# Altium schematic sheet [31] - PWR BATTERY CHARGER.SchDoc
size A3; DocumentNumber: 31; SheetNumber: 31; SheetTotal: 32
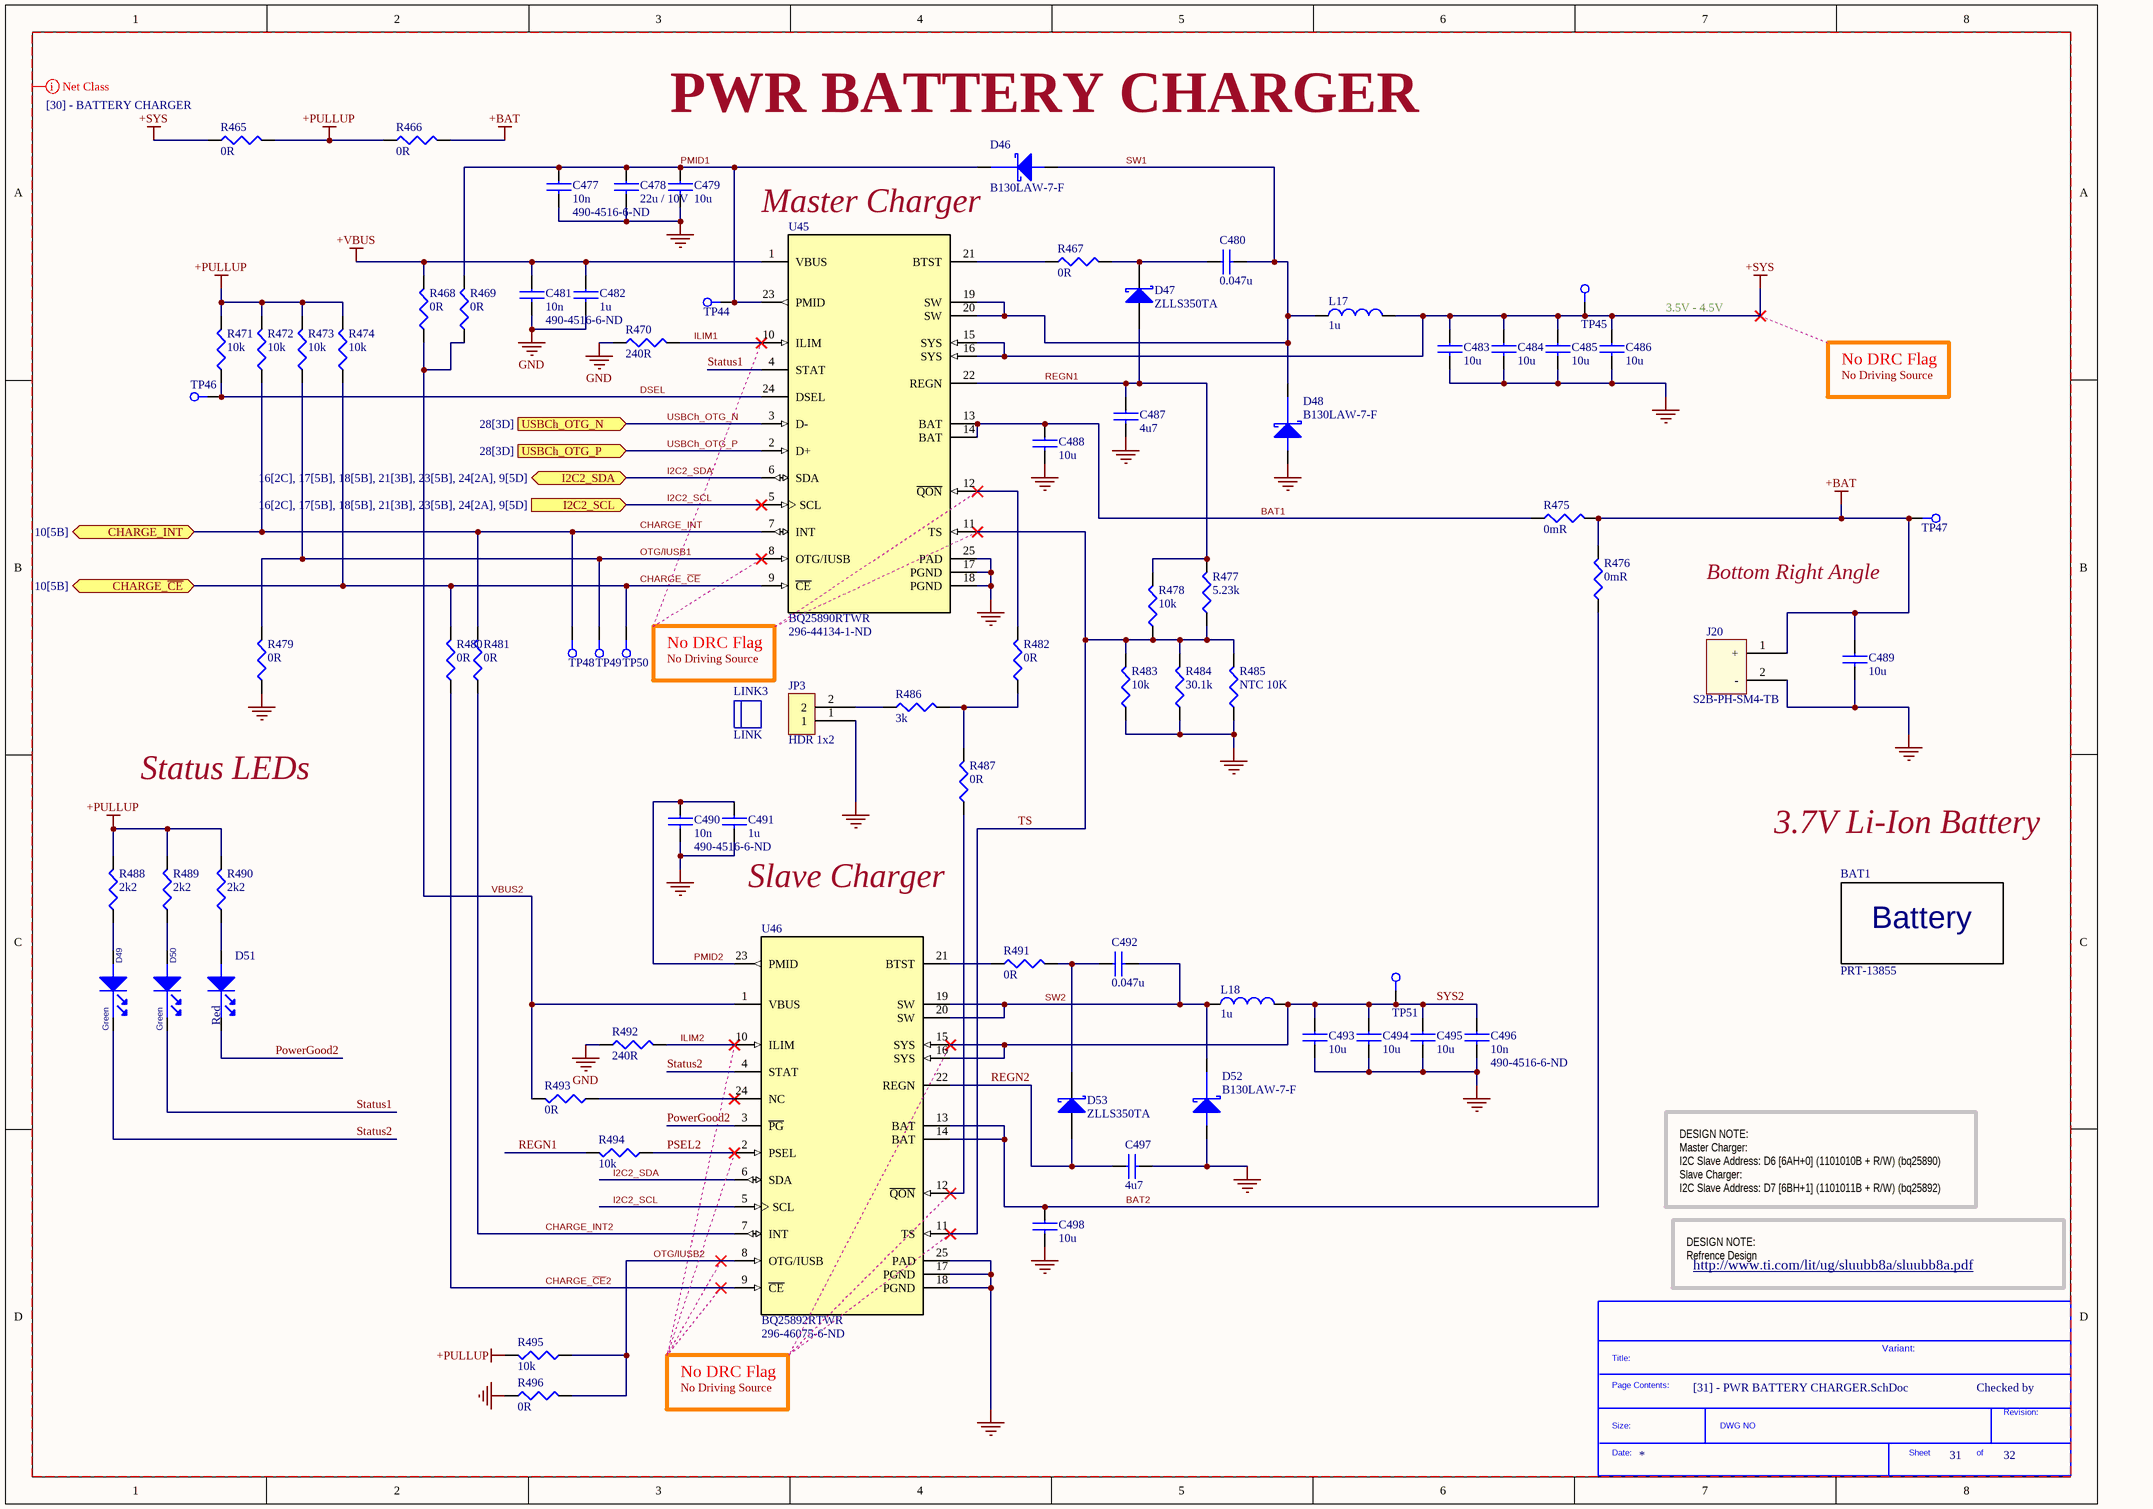
[diagram p0: [31] - PWR BATTERY CHARGER.SchDoc]

## Parts
*  SDTitleBlock  (value not drawn)  (graphical)
BAT1  PRT-13855  [Li-Ion Bat]
C477  10n  Supplier Part Number 2: 490-4516-6-ND  [C0402]
C478  22u / 10V  [C0603]
C479  10u  [C0603]
C480  0.047u  [C0402]
C481  10n  Supplier Part Number 2: 490-4516-6-ND  [C0402]
C482  1u  [C0402]
C483  10u  [C0603]
C484  10u  [C0603]
C485  10u  [C0603]
C486  10u  [C0603]
C487  4u7  [C0402]
C488  10u  [C0603]
C489  10u  [C0603]
C490  10n  Supplier Part Number 2: 490-4516-6-ND  [C0402]
C491  1u  [C0402]
C492  0.047u  [C0402]
C493  10u  [C0603]
C494  10u  [C0603]
C495  10u  [C0603]
C496  10n  Supplier Part Number 2: 490-4516-6-ND  [C0402]
C497  4u7  [C0402]
C498  10u  [C0603]
D46  B130LAW-7-F  [SOD-123FL]
D47  ZLLS350TA  [SOD-523]
D48  B130LAW-7-F  [SOD-123FL]
D49  Green  [LED_0603]
D50  Green  [LED_0603]
D51  Red  [LED_0603]
D52  B130LAW-7-F  [SOD-123FL]
D53  ZLLS350TA  [SOD-523]
J20  S2B-PH-SM4-TB  [S2B-PH-SM4-TB]
JP3  HDR 1x2  [HDR_1x2_2.54MM]
L17  1u  [IHLP_204MILX216MIL]
L18  1u  [IHLP_204MILX216MIL]
LINK3  LINK  (mechanical)
R465  0R  [R0402]
R466  0R  [R0402]
R467  0R  [R0402]
R468  0R  [R0402]
R469  0R  [R0402]
R470  240R  [R0201]
R471  10k  [R0201]
R472  10k  [R0201]
R473  10k  [R0201]
R474  10k  [R0201]
R475  0mR  [R2512]
R476  0mR  [R2512]
R477  5.23k  [R0402]
R478  10k  [R0402]
R479  0R  [R0402]
R480  0R  [R0402]
R481  0R  [R0402]
R482  0R  [R0402]
R483  10k  [R0402]
R484  30.1k  [R0402]
R485  NTC 10K  [R0402]
R486  3k  [R0402]
R487  0R  [R0402]
R488  2k2  [R0402]
R489  2k2  [R0402]
R490  2k2  [R0402]
R491  0R  [R0402]
R492  240R  [R0201]
R493  0R  [R0402]
R494  10k  [R0201]
R495  10k  [R0201]
R496  0R  [R0402]
TP44  TP_25MILC  [TP_25C]  (value not drawn)  (no BOM)
TP45  TP_25MILC  [TP_25C]  (value not drawn)  (no BOM)
TP46  TP_25MILC  [TP_25C]  (value not drawn)  (no BOM)
TP47  TP_25MILC  [TP_25C]  (value not drawn)  (no BOM)
TP48  TP_25MILC  [TP_25C]  (value not drawn)  (no BOM)
TP49  TP_25MILC  [TP_25C]  (value not drawn)  (no BOM)
TP50  TP_25MILC  [TP_25C]  (value not drawn)  (no BOM)
TP51  TP_25MILC  [TP_25C]  (value not drawn)  (no BOM)
U45  BQ25890RTWR  Supplier Part Number 2: 296-44134-1-ND  [RTW0024H]
U46  BQ25892RTWR  Supplier Part Number 1: 296-46075-6-ND  [RTW0024H]

## Ports
CHARGE_INT (bidir, see 10[5B]), CHARGE_~{CE} (bidir, see 10[5B]), I2C2_SCL (in, see 16[2C], 17[5B], 18[5B], 21[3B], 23[5B], 24[2A], 9[5D]), I2C2_SDA (bidir, see 16[2C], 17[5B], 18[5B], 21[3B], 23[5B], 24[2A], 9[5D]), USBCh_OTG_N (in, see 28[3D]), USBCh_OTG_P (in, see 28[3D])

## Nets
+BAT: C489.1 J20.1(+) R466.2 R475.2 R476.2 TP47.1
+PULLUP: R465.2 R466.1 R471.2 R472.2 R473.2 R474.2 R488.2 R489.2 R490.2 R495.2
+SYS: C483.1 C484.1 C485.1 C486.1 L17.2 R465.1 TP45.1 U45.15(SYS) U45.16(SYS)
+VBUS: C481.1 C482.1 R468.2 U45.1(VBUS)
GND: C477.2 C478.2 C479.2 C481.2 C482.2 C483.2 C484.2 C485.2 C486.2 C487.2 C488.2 C489.2 C490.2 C491.2 C493.2 C494.2 C495.2 C496.2 C497.2 C498.2 D48.2(Anode) D52.2(Anode) J20.2(-) JP3.1 R470.1 R479.1 R483.1 R484.1 R485.1 R492.1 R496.1 U45.17(PGND) U45.18(PGND) U45.25(PAD) U46.17(PGND) U46.18(PGND) U46.25(PAD)
BAT1: C488.1 R475.1 U45.13(BAT) U45.14(BAT)
BAT2: C498.1 R476.1 U46.13(BAT) U46.14(BAT)
CHARGE_~{CE}: R474.1 R480.2 TP50.1 U45.9(~{CE}) ; port CHARGE_~{CE}
CHARGE_~{CE}2: R480.1 U46.9(~{CE})
CHARGE_INT: R472.1 R481.2 TP48.1 U45.7(INT) ; port CHARGE_INT
CHARGE_INT2: R481.1 U46.7(INT)
DSEL: R471.1 TP46.1 U45.24(DSEL)
I2C2_SCL: U45.5(SCL) U46.5(SCL) ; port I2C2_SCL
I2C2_SDA: U45.6(SDA) U46.6(SDA) ; port I2C2_SDA
ILIM1: R470.2 U45.10(ILIM)
ILIM2: R492.2 U46.10(ILIM)
OTG/IUSB1: R473.1 R479.2 TP49.1 U45.8(OTG/IUSB)
OTG/IUSB2: R495.1 R496.2 U46.8(OTG/IUSB)
PMID1: C477.1 C478.1 C479.1 D46.1(Cathode) R469.2 TP44.1 U45.23(PMID)
PMID2: C490.1 C491.1 U46.23(PMID)
PowerGood2: D51.1(cathode) U46.3(~{PG})
PSEL2: R494.1 U46.2(PSEL)
REGN1: C487.1 D47.2(A) R477.2 R478.2 R494.2 U45.22(REGN)
REGN2: C497.1 D53.2(A) U46.22(REGN)
Status1: D50.1(cathode) U45.4(STAT)
Status2: D49.1(cathode) U46.4(STAT)
SW1: C480.2 D46.2(Anode) D48.1(Cathode) L17.1 U45.19(SW) U45.20(SW)
SW2: C492.2 D52.1(Cathode) L18.1 U46.19(SW) U46.20(SW)
SYS2: C493.1 C494.1 C495.1 C496.1 L18.2 TP51.1 U46.15(SYS) U46.16(SYS)
TS: R477.1 R478.1 R483.2 R484.2 R485.2 U45.11(TS) U46.11(TS)
USBCh_OTG_N: U45.3(D-) ; port USBCh_OTG_N
USBCh_OTG_P: U45.2(D+) ; port USBCh_OTG_P
VBUS2: R468.1 R469.1 R493.2 U46.1(VBUS)
NetC480_1: C480.1 D47.1(K) R467.2
NetC492_1: C492.1 D53.1(K) R491.2
NetD49_2: D49.2(ANODE) R488.1
NetD50_2: D50.2(ANODE) R489.1
NetD51_2: D51.2(ANODE) R490.1
NetJP3_2: JP3.2 R486.1
NetR467_1: R467.1 U45.21(BTST)
NetR482_1: R482.1 R486.2 R487.2
NetR482_2: R482.2 U45.12(~{QON})
NetR487_1: R487.1 U46.12(~{QON})
NetR491_1: R491.1 U46.21(BTST)
NetR493_1: R493.1 U46.24(NC)

## Layout directives
net class [30] - BATTERY CHARGER: +BAT, +PULLUP, +SYS, +VBUS, BAT1, BAT2, CHARGE_INT, CHARGE_INT2, CHARGE_~{CE}, CHARGE_~{CE}2, DSEL, GND, I2C2_SCL, I2C2_SDA, ILIM1, ILIM2, OTG/IUSB1, OTG/IUSB2, PMID1, PMID2, PowerGood2, PSEL2, REGN1, REGN2, Status1, Status2, SW1, SW2, SYS2, TS, USBCh_OTG_N, USBCh_OTG_P, VBUS2

## Notes on the sheet
- (near D46) PWR BATTERY CHARGER
- (near D46) Master Charger
- 3.5V - 4.5V
- No DRC Flag
- No Driving Source
- Bottom Right Angle
- Status LEDs
- 3.7V Li-Ion Battery
- (near C491) Slave Charger
- DESIGN NOTE:
  Master Charger:
  I2C Slave Address: D6 [6AH+0] (1101010B + R/W) (bq25890)
  Slave Charger:
  I2C Slave Address: D7 [6BH+1] (1101011B + R/W) (bq25892)
- DESIGN NOTE:
  Refrence Design
- http://www.ti.com/lit/ug/sluubb8a/sluubb8a.pdf
- Variant:
- Checked by
- (in symbol PRT-13855) Battery
- (in symbol SDTitleBlock) Title:; Page Contents:; Revision:; Size:; DWG NO; Date:; Sheet; of

## Library data of the parts
BAT1 = PRT-13855: LITHIUM ION BATTERY - 2AH; Manufacturer: SparkFun Electronics; Battery Chemistry: Lithium-Ion; Shipping Info: Due to possible restrictions, a change in ship method may be required.; .Creator: MB; Supplier 1: Digi-Key; Manufacturer Part Number: PRT-13855; RoHS: Not Applicable; Category: Battery Products; Stock 1: 246; Pricing 1: 1=12.95 (USD); Part Status: Active; Battery Cell Size: -; Capacity: 2Ah; Size / Dimension: 2.40" L x 2.10" W x 0.25" H (61.0mm x 53.3mm x 6.4mm); Termination Style: Wire Leads with Connector; Discharge Rate: -; Standard Charge Current: -; Standard Charge Time: -; Weight: -; ComponentLink1URL: https://media.digikey.com/pdf/Data%20Sheets/Sparkfun%20PDFs/PRT-13855_Web.pdf; ComponentLink1Description: https://media.digikey.com/pdf/Data%20Sheets/Sparkfun%20PDFs/PRT-13855_Web.pdf; Supplier Part Number 1: 1568-1686-ND; .Checked PCB: *
C477 C481 C490 C496 = C1005X7R1H103K: CAP CER 10000PF 50V 10% X7R 0402; Manufacturer: TDK Corporation; Value: 10nF; .Checked PCB: used; Capacitance: 10000pF; Category: Capacitors; Supplier Part Number: 445-6850-1-ND; Manufacturer Part Number: C1005X7R1H103K; Operating Temperature: -55°C ~ 125°C; Package / Case: 0402 (1005 Metric); Price 1k [$]: 0.01625; .Checked SCH: used; Voltage - Rated: 50V; Supplier: Digikey; Supplier 1: Digi-Key; Supplier Part Number 1: 445-6850-1-ND; RoHS: RoHS Compliant; Stock 1: 3901; Pricing 1: 1=0.2, 10=0.125, 100=0.045, 250=0.03252, 500=0.024, 1000=0.01625 (USD); Tolerance: ±10%; Temperature Coefficient: X7R; Mounting Type: Surface Mount, MLCC; Applications: General Purpose; Ratings: -; Size / Dimension: 0.039" L x 0.020" W (1.00mm x 0.50mm); Height - Seated (Max): -; Thickness (Max): 0.022" (0.55mm); Lead Spacing: -; Features: -; Packaging: Cut Tape (CT); Lead Style: -; ComponentLink1URL: http://www.tdk.co.jp/tefe02/e412_c.pdf; ComponentLink1Description: http://www.tdk.co.jp/tefe02/e412_c.pdf; Supplier 2: Digi-Key
C478 = C1608X5R1A226M080AC: CAP CER 22UF 10V X5R 0603; Manufacturer: TDK Corporation; Capacitance: 22µF; Tolerance: ±20%; .Creator: MM; .Checked SCH: used; Supplier 1: Digi-Key; Manufacturer Part Number: C1608X5R1A226M080AC; RoHS: RoHS Compliant; Category: Capacitors; Stock 1: 405620; Pricing 1: 1=0.49, 10=0.469, 100=0.2275, 250=0.189, 500=0.1715, 1000=0.1575 (USD); Packaging: Cut Tape (CT); Voltage - Rated: 10V; Temperature Coefficient: X5R; Mounting Type: Surface Mount, MLCC; Operating Temperature: -55°C ~ 85°C; Applications: General Purpose; Ratings: -; Package / Case: 0603 (1608 Metric); Size / Dimension: 0.063" L x 0.031" W (1.60mm x 0.80mm); Height - Seated (Max): -; Thickness (Max): 0.035" (0.90mm); Lead Spacing: -; Features: -; Lead Style: -; ComponentLink1URL: http://product.tdk.com/en/catalog/datasheets/mlcc_commercial_general_en.pdf; ComponentLink1Description: http://product.tdk.com/en/catalog/datasheets/mlcc_commercial_general_en.pdf; Supplier Part Number 1: 445-9077-1-ND; .Checked PCB: used; Supplier 2: Digi-Key; Supplier Part Number 2: 1276-1274-1-ND
C479 C483-C486 C488 C489 C493-C495 C498 = C1608X5R0J106M: CAP CER 10UF 6.3V X5R 20% 0603; Manufacturer: TDK Corporation; Capacitance: 10µF; Value: 10µF; .Checked PCB: used; Category: Capacitors; Supplier Part Number: 445-4112-1-ND; Manufacturer Part Number: C1608X5R0J106M; Operating Temperature: -55°C ~ 85°C; Package / Case: 0603 (1608 Metric); Price 1k [$]: 0.08580; .Checked SCH: used; Voltage - Rated: 6.3V; Features: Low ESR; Supplier: Digikey; Supplier 1: Digi-Key; Supplier Part Number 1: 445-4112-1-ND; RoHS: RoHS Compliant; Stock 1: 48157; Pricing 1: 1=0.46, 10=0.363, 100=0.1898, 250=0.14024, 500=0.1089, 1000=0.0858 (USD); Tolerance: ±20%; Temperature Coefficient: X5R; Mounting Type: Surface Mount, MLCC; Applications: General Purpose; Ratings: -; Size / Dimension: 0.063" L x 0.031" W (1.60mm x 0.80mm); Height - Seated (Max): -; Thickness (Max): 0.037" (0.95mm); Lead Spacing: -; Packaging: Cut Tape (CT); Lead Style: -; ComponentLink1URL: http://www.tdk.com/pdf/general_B11.pdf; ComponentLink1Description: http://www.tdk.com/pdf/general_B11.pdf
C480 C492 = GRM155R71E473KA88D: CAP CER 0.047UF 25V X7R 0402; Manufacturer: Murata Electronics North America; Tolerance: ±10%; Notification: Current market demand for these product types have resulted in fluctuating and extending lead times. Lead times may differ.; .Creator: MB; Supplier 1: Digi-Key; Manufacturer Part Number: GRM155R71E473KA88D; RoHS: RoHS Compliant; Category: Capacitors; Stock 1: 1130803; Pricing 1: 1=0.1, 10=0.024, 100=0.0109, 500=0.00778, 1000=0.00611, 2500=0.00556, 5000=0.00511 (USD); Packaging: Cut Tape (CT); Part Status: Active; Voltage - Rated: 25V; Temperature Coefficient: X7R; Operating Temperature: -55°C ~ 125°C; Features: -; Ratings: -; Applications: General Purpose; Mounting Type: Surface Mount, MLCC; Package / Case: 0402 (1005 Metric); Size / Dimension: 0.039" L x 0.020" W (1.00mm x 0.50mm); Height - Seated (Max): -; Thickness (Max): 0.022" (0.55mm); Lead Spacing: -; Lead Style: -; ComponentLink1URL: https://www.murata.com/~/media/webrenewal/support/library/catalog/products/capacitor/mlcc/c02e.ashx; ComponentLink1Description: https://www.murata.com/~/media/webrenewal/support/library/catalog/products/capacitor/mlcc/c02e.ashx; Supplier Part Number 1: 490-3254-1-ND; .Checked SCH: *; .Checked PCB: *; Supplier 2: Digi-Key; Supplier Part Number 2: 399-15998-6-ND
C482 C491 = C1005X5R1C105K: CAP CER 1.0UF 16V X5R 0402; Manufacturer: TDK Corporation; Capacitance: 1.0µF; Value: 1uF; .Checked PCB: used; Tolerance: ±10%; Category: Capacitors; Supplier Part Number: 445-4978-1-ND; Manufacturer Part Number: C1005X5R1C105K; Operating Temperature: -55°C ~ 85°C; Package / Case: 0402 (1005 Metric); Price 1k [$]: 0.02080; .Checked SCH: used; Voltage - Rated: 16V; Supplier: Digikey; Supplier 1: Digi-Key; Supplier Part Number 1: 445-4978-1-ND; RoHS: RoHS Compliant; Stock 1: 341010; Pricing 1: 1=0.24, 10=0.16, 100=0.064, 250=0.046, 500=0.0328, 1000=0.024 (USD); Temperature Coefficient: X5R; Mounting Type: Surface Mount, MLCC; Applications: General Purpose; Ratings: -; Size / Dimension: 0.039" L x 0.020" W (1.00mm x 0.50mm); Height - Seated (Max): -; Thickness (Max): 0.022" (0.55mm); Lead Spacing: -; Features: -; Packaging: Cut Tape (CT); Lead Style: -; ComponentLink1URL: http://www.tdk.co.jp/tefe02/e412_c.pdf; ComponentLink1Description: http://www.tdk.co.jp/tefe02/e412_c.pdf; Supplier 2: Digi-Key; Supplier Part Number 2: 445-13181-1-ND
C487 C497 = C1005X5R1A475M: CAP CER 4.7UF 10V 20% X5R 0402; Manufacturer: TDK Corporation; Capacitance: 4.7µF; .Checked PCB: used; Supplier 1: Digi-Key; Supplier Part Number 1: 445-8023-1-ND; Manufacturer Part Number: C1005X5R1A475M; RoHS: RoHS Compliant; Category: Capacitors; Stock 1: 10140; Pricing 1: 1=0.53, 10=0.415, 100=0.25, 250=0.18752, 500=0.16, 1000=0.125, 5000=0.095 (USD); Voltage - Rated: 10V; Tolerance: ±20%; Temperature Coefficient: X5R; Mounting Type: Surface Mount, MLCC; Operating Temperature: -55°C ~ 85°C; Applications: General Purpose; Ratings: -; Package / Case: 0402 (1005 Metric); Size / Dimension: 0.039" L x 0.020" W (1.00mm x 0.50mm); Height - Seated (Max): -; Thickness (Max): -; Lead Spacing: -; Features: -; Packaging: Cut Tape (CT); Lead Style: -; ComponentLink1URL: http://www.tdk.com/pdf/general_B11.pdf; ComponentLink1Description: http://www.tdk.com/pdf/general_B11.pdf; .Checked SCH: used
D46 D48 D52 = B130LAW-7-F: DIODE SCHOTTKY 30V 1A SOD123; Manufacturer: Diodes Incorporated; Speed: Fast Recovery =< 500ns, > 200mA (Io); Capacitance @ Vr, F: 40pF @ 10V, 1MHz; .Creator: MB; Supplier 1: Digi-Key; Manufacturer Part Number: B130LAW-7-F; RoHS: RoHS Compliant; Category: Discrete Semiconductor Products; Stock 1: 84030; Pricing 1: 1=0.39, 10=0.314, 100=0.2139, 500=0.16044, 1000=0.12032 (USD); Packaging: Cut Tape (CT); Part Status: Active; Diode Type: Schottky; Current - Average Rectified (Io): 1A; Mounting Type: Surface Mount; Package / Case: SOD-123; Supplier Device Package: SOD-123; Operating Temperature - Junction: -55°C ~ 125°C; Base Part Number: B130; ComponentLink1URL: https://www.diodes.com/assets/Datasheets/ds30308.pdf; ComponentLink1Description: https://www.diodes.com/assets/Datasheets/ds30308.pdf; .Checked SCH: *; .Checked PCB: *; Supplier Part Number 1: B130LAW-FDICT-ND
D47 D53 = ZLLS350TA: DIODE SCHOTTKY 40V 380MA SOD523; Manufacturer: Diodes Incorporated; Current - Average Rectified (Io): 380mA (DC); Speed: Fast Recovery =< 500ns, > 200mA (Io); Capacitance @ Vr, F: 6pF @ 30V, 1MHz; .Creator: MB; Supplier 1: Digi-Key; Manufacturer Part Number: ZLLS350TA; RoHS: RoHS Compliant; Category: Discrete Semiconductor Products; Stock 1: 219851; Pricing 1: 1=0.47, 10=0.404, 100=0.3014, 500=0.2368, 1000=0.18298 (USD); Packaging: Cut Tape (CT); Part Status: Active; Diode Type: Schottky; Mounting Type: Surface Mount; Package / Case: SC-79, SOD-523; Supplier Device Package: SOD-523; Operating Temperature - Junction: 150°C (Max); Base Part Number: ZLLS350; ComponentLink1URL: https://www.diodes.com/assets/Datasheets/ZLLS350.pdf; ComponentLink1Description: https://www.diodes.com/assets/Datasheets/ZLLS350.pdf; .Checked PCB: *; .Checked SCH: *; Supplier Part Number 1: ZLLS350TACT-ND
D49 D50 = LG L29K-G2J1-24-Z: LED SMARTLED GREEN 570NM 0603; Manufacturer: OSRAM Opto Semiconductors Inc; .Checked PCB: used; Current - Test: 2mA; Voltage - Forward (Vf) Typ: 1.7V; Luminous Flux @ Current - Test: 12 mlm; Millicandela Rating: 3.92mcd; Wavelength - Peak: 572nm; Lens Type: Diffused; Lens Style/Size: Rectangle with Flat Top, 1.3mm x 0.8mm; Viewing Angle: 160°; Regulator Topology: Positive Fixed; Voltage - Output: 2.5V; Voltage - Input: 2.6 V ~ 6 V; Voltage - Dropout (Typical): 0.16V @ 500mA; Number of Regulators: 1; Current - Output: 500mA; Current - Limit (Min): 600mA; .Checked SCH: used; Category: Optoelectronics; Supplier Part Number: 475-2709-1-ND; Family: LEDs - <75mA, Discre; Manufacturer Part Number: LG L29K-G2J1-24-Z; Price 1k [$]: 0.08744; Value: Green; Color: Green; Package / Case: 0603 (1608 Metric); Supplier: Digikey; Supplier 1: Digi-Key; Supplier Part Number 1: 475-2709-1-ND; RoHS: RoHS Compliant; Stock 1: 30318; Pricing 1: 1=0.16, 10=0.137, 100=0.1093, 250=0.09564, 500=0.08744 (USD); Wavelength - Dominant: 570nm; Size / Dimension: 1.70mm L x 0.80mm W; Height: 0.65mm; Mounting Type: Surface Mount; Packaging: Cut Tape (CT); ComponentLink1URL: http://catalog.osram-os.com/catalogue/catalogue.do;jsessionid=32CB61882C089EDD4B6D0A54E7E1F117?act=downloadFile&favOid=020000020000138e000100b6; ComponentLink1Description: http://catalog.osram-os.com/catalogue/catalogue.do;jsessionid=32CB61882C089EDD4B6D0A54E7E1F117?act=downloadFile&favOid=020000020000138e000100b6; Operating Temperature: -40°C ~ 125°C; Supplier Device Package: 6-TMLF® (1.6x1.6); ComponentLink2URL: http://www.micrel.com/_PDF/mic5353.pdf; ComponentLink2Description: http://www.micrel.com/_PDF/mic5353.pdf
D51 = LS L29K-H1J2-1-Z: LED SMARTLED RED 630NM 0603 SMD; Manufacturer: OSRAM Opto Semiconductors Inc; Millicandela Rating: 4.95mcd; Voltage - Forward (Vf) Typ: 1.8V; Current - Test: 2mA; Wavelength - Peak: 643nm; Viewing Angle: 160°; Lens Type: Diffused; Lens Style/Size: Rectangle with Flat Top, 1.3mm x 0.8mm; Luminous Flux @ Current - Test: 20 mlm; .Checked PCB: used; Supplier 1: Digi-Key; Supplier Part Number 1: 475-1195-1-ND; Manufacturer Part Number: LS L29K-H1J2-1-Z; RoHS: RoHS Compliant; Category: Optoelectronics; Stock 1: 71670; Pricing 1: 1=0.16, 10=0.137, 100=0.1093, 250=0.09564, 500=0.08744 (USD); Color: Red; Wavelength - Dominant: 630nm; Package / Case: 0603 (1608 Metric); Size / Dimension: 1.70mm L x 0.80mm W; Height: 0.65mm; Mounting Type: Surface Mount; Packaging: Cut Tape (CT); ComponentLink1URL: http://catalog.osram-os.com/catalogue/catalogue.do;jsessionid=DB7CFDBAC5AF1E216E45F622E867085A?act=downloadFile&favOid=020000010003f9de000100b6; ComponentLink1Description: http://catalog.osram-os.com/catalogue/catalogue.do;jsessionid=DB7CFDBAC5AF1E216E45F622E867085A?act=downloadFile&favOid=020000010003f9de000100b6; .Checked SCH: used
J20 = S2B-PH-SM4-TB: CONN HEADER PH SIDE 2POS 2MM SMD; Manufacturer: JST Sales America Inc.; Manufacturer Part Number: S2B-PH-SM4-TB(LF)(SN); Pitch - Mating: 0.079" (2.00mm); Number of Positions: 2; Number of Positions Loaded: All; Style: Board to Cable/Wire; Shrouding: Shrouded - 4 Wall; Contact Length - Mating: 0.130" (3.30mm); Material Flammability Rating: UL94 V-0; Current Rating: 2A; Voltage Rating: 100V; Mated Stacking Heights: 5.5mm; .Creator: MB; Supplier 1: Digi-Key; RoHS: RoHS Compliant; Category: Connectors, Interconnects; Stock 1: 44865; Pricing 1: 1=0.58, 10=0.547, 100=0.4194, 500=0.3647 (USD); Packaging: Cut Tape (CT); Part Status: Active; Connector Type: Header; Contact Type: Male Pin; Number of Rows: 1; Row Spacing - Mating: -; Mounting Type: Surface Mount, Right Angle; Termination: Solder; Fastening Type: Detent Lock; Contact Length - Post: -; Overall Contact Length: -; Insulation Height: 0.217" (5.51mm); Contact Shape: Square; Contact Finish - Mating: Tin; Contact Finish Thickness - Mating: -; Contact Finish - Post: Tin; Contact Material: Copper Alloy; Insulation Material: Polyamide (PA6T), Nylon 6T; Features: Solder Retention; Operating Temperature: -25°C ~ 85°C; Ingress Protection: -; Insulation Color: Natural; Contact Finish Thickness - Post: -; Applications: -; ComponentLink1URL: http://www.jst-mfg.com/product/pdf/eng/ePH.pdf; ComponentLink1Description: http://www.jst-mfg.com/product/pdf/eng/ePH.pdf; Supplier Part Number 1: 455-1749-1-ND; .Checked SCH: *; .Checked PCB: *
JP3 = 68001-202HLF: BERGSTIK II .100" SR STRAIGHT; Manufacturer: FCI; Connector Type: Header, Unshrouded; Number of Positions: 2; Number of Positions Loaded: All; Pitch: 0.100" (2.54mm); .Checked PCB: used; Supplier 1: Digi-Key; Supplier Part Number 1: 609-3469-ND; Manufacturer Part Number: 68001-202HLF; RoHS: RoHS Compliant; Category: Connectors, Interconnects; Stock 1: 13680; Pricing 1: 1=0.45, 10=0.265, 100=0.1172, 250=0.09828, 500=0.09072, 1000=0.07938, 5000=0.05065 (USD); Contact Type: Male Pin; Number of Rows: 1; Row Spacing: -; Contact Mating Length: 0.230" (5.84mm); Mounting Type: Through Hole; Termination: Solder; Fastening Type: -; Features: -; Contact Finish: Gold; Contact Finish Thickness: 15µin (0.38µm); Color: Black; Packaging: Bulk; ComponentLink1URL: http://portal.fciconnect.com/res/en/pdffiles/doc_search/68000.pdf; ComponentLink1Description: http://portal.fciconnect.com/res/en/pdffiles/doc_search/68000.pdf; .Checked SCH: used
L17 L18 = IHLP2020BZER1R0M11: INDUCTOR POWER 1.0UH 7.5A SMD; Manufacturer: Vishay Dale; Type: Molded; Inductance: 1µH; Tolerance: ±20%; Current - Saturation: 7A; Shielding: Shielded; DC Resistance (DCR): 18.1 mOhm Max; Frequency - Self Resonant: 66MHz; Frequency - Test: 100kHz; .Checked PCB: used; .Creator: MM; Supplier 1: Digi-Key; Manufacturer Part Number: IHLP2020BZER1R0M11; RoHS: RoHS Compliant; Category: Inductors, Coils, Chokes; Stock 1: 8442; Pricing 1: 1=2.4, 10=2.24, 100=1.664, 500=1.408, 1000=1.312 (USD); Packaging: Cut Tape (CT); Material - Core: -; Current Rating: 7.5A; Q @ Freq: -; Operating Temperature: -55°C ~ 125°C; Mounting Type: Surface Mount; Package / Case: Non Standard; Size / Dimension: 0.216" L x 0.204" W (5.49mm x 5.18mm); Height - Seated (Max): 0.079" (2.00mm); Supplier Device Package: -; Supplier Part Number 1: 541-1218-1-ND; .Checked SCH: used
LINK3 = QPC02SXGN-RC: CONN JUMPER SHORTING .100" GOLD; Manufacturer: Sullins Connector Solutions; Gender: Female Sockets; Number of Positions or Pins (Grid): 2 (1 x 2); Pitch: 0.100" (2.54mm); .Checked PCB: used; Supplier 1: Digi-Key; Supplier Part Number 1: S9337-ND; Manufacturer Part Number: QPC02SXGN-RC; RoHS: RoHS Compliant; Category: Connectors, Interconnects; Stock 1: 23274; Pricing 1: 1=0.11, 10=0.066, 25=0.0468, 50=0.0384, 100=0.033, 250=0.02792, 500=0.0258, 1000=0.0228, 2500=0.018 (USD); Type: Open Top; Height: 0.235" (5.97mm); Contact Finish: Gold; Contact Finish Thickness: Flash; Color: -; Packaging: Bulk; ComponentLink1URL: http://www.sullinscorp.com/drawings/284_SXGN_11510.pdf; ComponentLink1Description: http://www.sullinscorp.com/drawings/284_SXGN_11510.pdf; .Checked SCH: used
R465-R469 R479-R482 R487 R491 R493 R496 = RC0402JR-070RL: RES 0.0 OHM 1/16W 0402 SMD; Manufacturer: Yageo; Resistance (Ohms): 0.0; Power (Watts): 0.063W, 1/16W; Tolerance: Jumper; .Checked PCB: used; Category: Resistors; Supplier Part Number: 311-0.0JRCT-ND; Manufacturer Part Number: RC0402JR-070RL; Package / Case: 0402 (1005 Metric); Price 1k [$]: 0.01389; Value: 0R; .Checked SCH: used; Supplier: Digikey; Supplier 1: Digi-Key; Supplier Part Number 1: 311-0.0JRCT-ND; RoHS: RoHS Compliant; Stock 1: 1106330; Pricing 1: 10=0.012, 50=0.009, 100=0.0069, 250=0.00512, 500=0.0038, 1000=0.00253 (USD); Composition: Thick Film; Features: -; Temperature Coefficient: -; Size / Dimension: 0.039" L x 0.020" W (1.00mm x 0.50mm); Height: 0.016" (0.40mm); Number of Terminations: 2; Packaging: Cut Tape (CT); ComponentLink1URL: http://www.yageo.com/documents/recent/PYu-RC0402_51_RoHS_L_6.pdf; ComponentLink1Description: http://www.yageo.com/documents/recent/PYu-RC0402_51_RoHS_L_6.pdf
R470 R492 = RMCF0201FT240R: RES 240 OHM 1/20W 1% 0201; Manufacturer: Stackpole Electronics Inc; Resistance (Ohms): 240; Power (Watts): 0.05W, 1/20W; Temperature Coefficient: ±200ppm/°C; .Creator: MM; .Checked PCB: used; Supplier 1: Digi-Key; Manufacturer Part Number: RMCF0201FT240R; RoHS: RoHS Compliant; Category: Resistors; Stock 1: 37080; Pricing 1: 1=0.12, 10=0.084, 50=0.046, 100=0.035, 250=0.026, 500=0.0192, 1000=0.0128, 2500=0.0108, 5000=0.009 (USD); Packaging: Cut Tape (CT); Tolerance: ±1%; Composition: Thick Film; Features: -; Package / Case: 0201 (0603 Metric); Supplier Device Package: 0201; Size / Dimension: 0.024" L x 0.012" W (0.60mm x 0.30mm); Height: 0.009" (0.24mm); Number of Terminations: 2; ComponentLink1URL: http://www.seielect.com/Catalog/SEI-RMCF_RMCP.pdf; ComponentLink1Description: http://www.seielect.com/Catalog/SEI-RMCF_RMCP.pdf; Supplier Part Number 1: RMCF0201FT240RCT-ND; .Checked SCH: used
R471-R474 R494 R495 = RC0201FR-0710KL: RES 10K OHM 1/20W 1% 0201 SMD; Manufacturer: Yageo; Power (Watts): 0.05W, 1/20W; Temperature Coefficient: ±200ppm/°C; .Creator: MM; .Checked PCB: used; Supplier 1: Digi-Key; Manufacturer Part Number: RC0201FR-0710KL; RoHS: RoHS Compliant; Category: Resistors; Stock 1: 529049; Pricing 1: 1=0.1, 10=0.074, 25=0.054, 100=0.0303, 250=0.02312, 500=0.0185, 1000=0.01361, 2500=0.01182, 5000=0.00976 (USD); Packaging: Cut Tape (CT); Resistance (Ohms): 10k; Tolerance: ±1%; Composition: Thick Film; Features: Moisture Resistant; Package / Case: 0201 (0603 Metric); Supplier Device Package: 0201; Size / Dimension: 0.024" L x 0.012" W (0.60mm x 0.30mm); Height: 0.010" (0.26mm); Number of Terminations: 2; ComponentLink1URL: http://www.yageo.com/documents/recent/PYu-RC0201_51_RoHS_L_8.pdf; ComponentLink1Description: http://www.yageo.com/documents/recent/PYu-RC0201_51_RoHS_L_8.pdf; Supplier Part Number 1: 311-10.0KMCT-ND; .Checked SCH: used; Supplier 2: Digi-Key; Supplier Part Number 2: 541-10.0KABCT-ND
R475 R476 = CRCW25120000Z0EG: RES 0.0 OHM JUMPER 1W 2512; Manufacturer: Vishay Dale; Voltage Rating: 500V; Temperature Coefficient: 100ppm/°C; .Creator: MB; Supplier 1: Digi-Key; Manufacturer Part Number: CRCW25120000Z0EG; Stock 1: 41666; Pricing 1: 1=0.39, 10=0.333, 25=0.242, 50=0.1754, 100=0.1301, 250=0.09984, 500=0.07866, 1000=0.05445 (USD); Mount: Surface Mount; Case/Package: 2512; Number of Pins: 2; Weight: 0.001429oz; Case Code (Metric): 6432; Case Code (Imperial): 2512; Contact Plating: Tin; Min Operating Temperature: -55°C; Max Operating Temperature: 155°C; Resistance: 0mR; Packaging: Tape and Reel; Package Quantity: 2000; Power Rating: 1W; Composition: Thick Film; Number of Terminations: 2; Max Power Dissipation: 1W; Military Standard: Not; Termination: SMD/SMT; Length: 6.3mm; Height: 0.028inch; Width: 0.124inch; Depth: 3.15mm; Radiation Hardening: No; REACH SVHC: No SVHC; ComponentLink1URL: https://datasheet.ciiva.com/2478/dcrcwe3-2478338.pdf; ComponentLink1Description: https://datasheet.ciiva.com/2478/dcrcwe3-2478338.pdf; ComponentLink2URL: https://datasheet.ciiva.com/2478/dcrcwe3-2478339.pdf; ComponentLink2Description: https://datasheet.ciiva.com/2478/dcrcwe3-2478339.pdf; ComponentLink3URL: https://datasheet.ciiva.com/2478/dcrcwe3-2478340.pdf; ComponentLink3Description: https://datasheet.ciiva.com/2478/dcrcwe3-2478340.pdf; ComponentLink4URL: https://datasheet.ciiva.com/9109/dcrcwe3-9109958.pdf; ComponentLink4Description: https://datasheet.ciiva.com/9109/dcrcwe3-9109958.pdf; ComponentLink5URL: https://datasheet.ciiva.com/16777/70201119-16777511.pdf; ComponentLink5Description: https://datasheet.ciiva.com/16777/70201119-16777511.pdf; ComponentLink6URL: https://datasheet.ciiva.com/16782/70201119-16782055.pdf; ComponentLink6Description: https://datasheet.ciiva.com/16782/70201119-16782055.pdf; ComponentLink7URL: https://datasheet.ciiva.com/22665/1701828-22665687.pdf; ComponentLink7Description: https://datasheet.ciiva.com/22665/1701828-22665687.pdf; ComponentLink8URL: https://datasheet.ciiva.com/5545/dcrcwe3-109170-5545512.pdf; ComponentLink8Description: https://datasheet.ciiva.com/5545/dcrcwe3-109170-5545512.pdf; ComponentLink9URL: https://datasheet.ciiva.com/9109/dcrcwe3-9109960.pdf; ComponentLink9Description: https://datasheet.ciiva.com/9109/dcrcwe3-9109960.pdf; Supplier Part Number 1: 541-0.0XDKR-ND; .Checked SCH: *; .Checked PCB: *
R477 = CRCW04025K23FKED: RES SMD 5.23K OHM 1% 1/16W 0402; Manufacturer: Vishay Dale; Power (Watts): 0.063W, 1/16W; Temperature Coefficient: ±100ppm/°C; .Creator: MB; Supplier 1: Digi-Key; Manufacturer Part Number: CRCW04025K23FKED; RoHS: RoHS Compliant; Category: Resistors; Stock 1: 224047; Pricing 1: 1=0.1, 10=0.044, 100=0.0178, 1000=0.00802, 2500=0.00696, 5000=0.00575 (USD); Packaging: Cut Tape (CT); Part Status: Active; Tolerance: ±1%; Composition: Thick Film; Features: Automotive AEC-Q200; Operating Temperature: -55°C ~ 155°C; Package / Case: 0402 (1005 Metric); Supplier Device Package: 0402; Size / Dimension: 0.039" L x 0.020" W (1.00mm x 0.50mm); Height - Seated (Max): 0.016" (0.40mm); Failure Rate: -; ComponentLink1URL: http://www.vishay.com/docs/20035/dcrcwe3.pdf; ComponentLink1Description: http://www.vishay.com/docs/20035/dcrcwe3.pdf; Supplier Part Number 1: 541-5.23KLCT-ND; .Checked PCB: *; .Checked SCH: *; Supplier 2: Digi-Key; Stock 2: 246159; Pricing 2: 1=0.1, 10=0.044, 100=0.0178, 1000=0.00802, 2500=0.00696, 5000=0.00575 (USD); Supplier Part Number 2: 541-30.1KLCT-ND
R478 R483 = RC0402FR-0710KL: RES 10.0K OHM 1/16W 1% 0402 SMD; Manufacturer: Yageo; Power (Watts): 0.063W, 1/16W; .Checked PCB: used; Temperature Coefficient: ±100ppm/°C; Category: Resistors; Supplier Part Number: 311-10.0KLRCT-ND; Manufacturer Part Number: RC0402FR-0710KL; Package / Case: 0402 (1005 Metric); Price 1k [$]: 0.01421; Resistance (Ohms): 10K; Tolerance: ±1%; Value: 10k; .Checked SCH: used; Supplier: Digikey; Supplier 1: Digi-Key; Supplier Part Number 1: 311-10.0KLRCT-ND; RoHS: RoHS Compliant; Stock 1: 2916495; Pricing 1: 10=0.014, 50=0.0104, 100=0.0079, 250=0.00584, 500=0.00432, 1000=0.00288 (USD); Composition: Thick Film; Features: -; Size / Dimension: 0.039" L x 0.020" W (1.00mm x 0.50mm); Height: 0.016" (0.40mm); Number of Terminations: 2; Packaging: Cut Tape (CT); ComponentLink1URL: http://www.yageo.com/documents/recent/PYu-RC0402_51_RoHS_L_6.pdf; ComponentLink1Description: http://www.yageo.com/documents/recent/PYu-RC0402_51_RoHS_L_6.pdf
R484 = CRCW040230K1FKED: RES SMD 30.1K OHM 1% 1/16W 0402; Manufacturer: Vishay Dale; Power (Watts): 0.063W, 1/16W; Temperature Coefficient: ±100ppm/°C; .Creator: MB; Supplier 1: Digi-Key; Manufacturer Part Number: CRCW040230K1FKED; RoHS: RoHS Compliant; Category: Resistors; Stock 1: 246159; Pricing 1: 1=0.1, 10=0.044, 100=0.0178, 1000=0.00802, 2500=0.00696, 5000=0.00575 (USD); Packaging: Digi-Reel®; Part Status: Active; Tolerance: ±1%; Composition: Thick Film; Features: Automotive AEC-Q200; Operating Temperature: -55°C ~ 155°C; Package / Case: 0402 (1005 Metric); Supplier Device Package: 0402; Size / Dimension: 0.039" L x 0.020" W (1.00mm x 0.50mm); Height - Seated (Max): 0.016" (0.40mm); Failure Rate: -; ComponentLink1URL: http://www.vishay.com/docs/20035/dcrcwe3.pdf; ComponentLink1Description: http://www.vishay.com/docs/20035/dcrcwe3.pdf; Supplier Part Number 1: 541-30.1KLDKR-ND; .Checked PCB: *; .Checked SCH: *; Supplier 2: Digi-Key; Supplier Part Number 2: 311-30.1KLRCT-ND
R485 = NTCG103JF103FT1: THERMISTOR NTC 10K OHM 1% 0402; Manufacturer: TDK; .Creator: MB; Supplier 1: Digi-Key; Manufacturer Part Number: NTCG103JF103FT1; Stock 1: 135498; Pricing 1: 1=0.1, 5=0.098, 10=0.088, 25=0.0808, 50=0.0646, 100=0.0554, 500=0.04852, 1000=0.04158, 5000=0.03696 (USD); Mount: Surface Mount; Case/Package: 0402; Number of Pins: 2; Case Code (Metric): 1005; Case Code (Imperial): 0402; Min Operating Temperature: -40°C; Max Operating Temperature: 125°C; Packaging: Tape and Reel; Tolerance: 1%; Package Quantity: 10000; Accuracy: 1%; Length: 1mm; Depth: 0.5mm; Radiation Hardening: No; ComponentLink1URL: https://datasheet.ciiva.com/2848/ntcg103jf103ft1-web-2848583.pdf; ComponentLink1Description: https://datasheet.ciiva.com/2848/ntcg103jf103ft1-web-2848583.pdf; ComponentLink2URL: https://datasheet.ciiva.com/2848/ntcg103jf103ft1-web-2848584.pdf; ComponentLink2Description: https://datasheet.ciiva.com/2848/ntcg103jf103ft1-web-2848584.pdf; ComponentLink3URL: https://datasheet.ciiva.com/2848/ntcg103jf103ft1-web-2848585.pdf; ComponentLink3Description: https://datasheet.ciiva.com/2848/ntcg103jf103ft1-web-2848585.pdf; Supplier Part Number 1: 445-2550-6-ND; .Checked SCH: *; .Checked PCB: *
R486 = RC0402FR-073KL: RES 3K OHM 1/16W 1% 0402 SMD; Manufacturer: Yageo; Power (Watts): 0.063W, 1/16W; Temperature Coefficient: ±100ppm/°C; .Creator: MM; .Checked SCH: used; Supplier 1: Digi-Key; Manufacturer Part Number: RC0402FR-073KL; RoHS: RoHS Compliant; Category: Resistors; Stock 1: 194271; Pricing 1: 1=0.1, 10=0.014, 25=0.0104, 100=0.0063, 250=0.0054, 500=0.00382, 1000=0.0027, 2500=0.00234, 5000=0.00203 (USD); Packaging: Cut Tape (CT); Resistance (Ohms): 3k; Tolerance: ±1%; Composition: Thick Film; Features: -; Package / Case: 0402 (1005 Metric); Supplier Device Package: 0402; Size / Dimension: 0.039" L x 0.020" W (1.00mm x 0.50mm); Height: 0.016" (0.40mm); Number of Terminations: 2; ComponentLink1URL: http://www.yageo.com/documents/recent/PYu-RC0402_51_RoHS_L_6.pdf; ComponentLink1Description: http://www.yageo.com/documents/recent/PYu-RC0402_51_RoHS_L_6.pdf; Supplier Part Number 1: 311-3KLRCT-ND; .Checked PCB: used
R488-R490 = RC0402FR-072K2L: RES 2.20K OHM 1/16W 1% 0402 SMD; Manufacturer: Yageo; Resistance (Ohms): 2.2K; Power (Watts): 0.063W, 1/16W; .Checked PCB: used; Temperature Coefficient: ±100ppm/°C; Category: Resistors; Supplier Part Number: 311-2.20KLRCT-ND; Manufacturer Part Number: RC0402FR-072K2L; Package / Case: 0402 (1005 Metric); Price 1k [$]: 0.01421; Tolerance: ±1%; Value: 2k2; .Checked SCH: used; Supplier: Digikey; Supplier 1: Digi-Key; Supplier Part Number 1: 311-2.20KLRCT-ND; RoHS: RoHS Compliant; Stock 1: 195154; Pricing 1: 10=0.014, 50=0.0104, 100=0.0079, 250=0.00584, 500=0.00432, 1000=0.00288 (USD); Composition: Thick Film; Features: -; Size / Dimension: 0.039" L x 0.020" W (1.00mm x 0.50mm); Height: 0.016" (0.40mm); Number of Terminations: 2; Packaging: Cut Tape (CT); ComponentLink1URL: http://www.yageo.com/documents/recent/PYu-RC0402_51_RoHS_L_6.pdf; ComponentLink1Description: http://www.yageo.com/documents/recent/PYu-RC0402_51_RoHS_L_6.pdf
TP44-TP51 = TP_25MILC: Test Point 25mil; .Checked PCB: used
U45 = BQ25890RTWR: IC LI-ION CHARGE MGMT 24WQFN; Manufacturer: Texas Instruments; Battery Chemistry: Lithium-Ion/Polymer; Number of Cells: 1; Fault Protection: Over Current, Over Temperature; Charge Current - Max: 5A; Voltage - Supply (Max): 14V; Interface: I²C, USB; .Creator: MB; Supplier 1: Digi-Key; Manufacturer Part Number: BQ25890RTWR; RoHS: RoHS Compliant; Category: Integrated Circuits (ICs); Stock 1: 4130; Pricing 1: 1=3.6, 10=3.236, 100=2.6512, 500=2.25694, 1000=1.90344 (USD); Packaging: Cut Tape (CT); Part Status: Active; Current - Charging: -; Programmable Features: -; Battery Pack Voltage: -; Operating Temperature: -40°C ~ 85°C (TA); Package / Case: 24-WFQFN Exposed Pad; Supplier Device Package: 24-WQFN (4x4); ComponentLink1URL: http://www.ti.com/lit/ds/symlink/bq25890.pdf; ComponentLink1Description: http://www.ti.com/lit/ds/symlink/bq25890.pdf; Supplier Part Number 1: 296-46074-1-ND; .Checked PCB: *; .Checked SCH: *; Supplier 2: Digi-Key; Stock 2: 565; Pricing 2: 1=3.87, 10=3.474, 100=2.846 (USD); ComponentLink2URL: http://www.ti.com/lit/ds/symlink/bq25898c.pdf; ComponentLink2Description: http://www.ti.com/lit/ds/symlink/bq25898c.pdf
U46 = BQ25892RTWR: IC LI-ION CHARGE MGMT 24WQFN; Manufacturer: Texas Instruments; Output Voltage: 4.6V; Output Current: 5A; Number of Cells: 1; Operating Supply Voltage: 14V; Supplier 1: Digi-Key; Manufacturer Part Number: BQ25892RTWR; Stock 1: 1514; Pricing 1: 1=3.6, 10=3.236, 100=2.6512, 500=2.25694, 1000=1.90344 (USD); Mount: Surface Mount; Contact Plating: Nickel,Gold; Min Operating Temperature: -40°C; Max Operating Temperature: 85°C; Lead Free: Lead Free; ComponentLink1URL: http://www.ti.com/lit/gpn/BQ25892; ComponentLink1Description: http://www.ti.com/lit/gpn/BQ25892; ComponentLink2URL: http://www.ti.com/lit/ds/symlink/bq25892.pdf; ComponentLink2Description: http://www.ti.com/lit/ds/symlink/bq25892.pdf